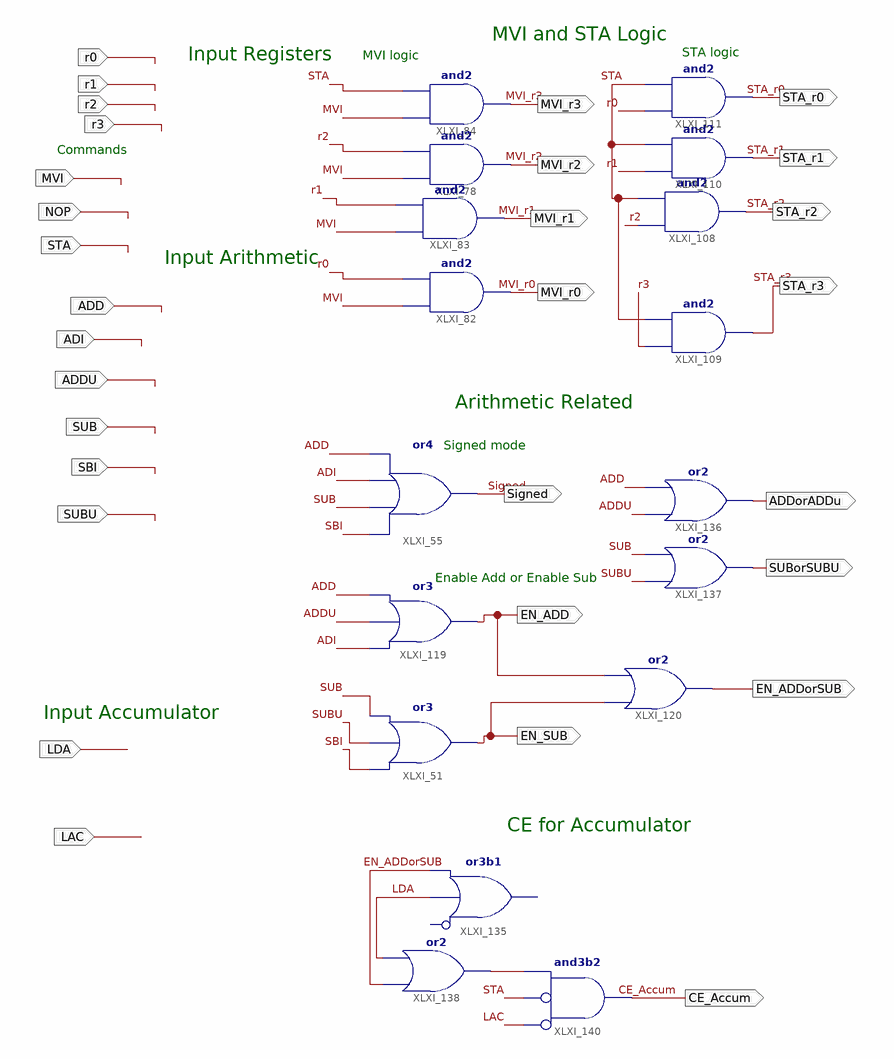
[diagram p0: schematic sheet 1]
// Xilinx ISE schematic ALU_Control_Logic.sch (spartan3e) as structural Verilog: 17 symbols, 30 ports
module ALU_Control_Logic (
  input  STA,
  input  MVI,
  input  r1,
  input  r0,
  input  r2,
  input  r3,
  input  NOP,
  input  ADD,
  input  ADI,
  input  ADDU,
  input  SUB,
  input  SBI,
  input  SUBU,
  input  LDA,
  input  LAC,
  output MVI_r3,
  output MVI_r2,
  output MVI_r1,
  output MVI_r0,
  output STA_r0,
  output STA_r1,
  output STA_r2,
  output STA_r3,
  output Signed,
  output EN_ADD,
  output EN_SUB,
  output EN_ADDorSUB,
  output SUBorSUBU,
  output ADDorADDu,
  output CE_Accum
);

  wire XLXN_1;

  and XLXI_84 (MVI_r3, MVI, STA);
  and XLXI_78 (MVI_r2, MVI, r2);
  and XLXI_83 (MVI_r1, MVI, r1);
  and XLXI_82 (MVI_r0, MVI, r0);
  and XLXI_108 (STA_r2, r2, STA);
  and XLXI_110 (STA_r1, r1, STA);
  and XLXI_111 (STA_r0, r0, STA);
  and XLXI_109 (STA_r3, r3, STA);
  or XLXI_55 (Signed, SBI, SUB, ADI, ADD);
  or XLXI_51 (EN_SUB, SBI, SUBU, SUB);
  or XLXI_119 (EN_ADD, ADI, ADDU, ADD);
  or XLXI_120 (EN_ADDorSUB, EN_SUB, EN_ADD);
  // or3b1 XLXI_135 has open pins: I0=open, I1=LDA, I2=EN_ADDorSUB, O=open
  or XLXI_136 (ADDorADDu, ADDU, ADD);
  or XLXI_137 (SUBorSUBU, SUBU, SUB);
  or XLXI_138 (XLXN_1, EN_ADDorSUB, LDA);
  and XLXI_140 (CE_Accum, ~LAC, ~STA, XLXN_1);  // and3b2

  // Notes on the sheet:
  //   MVI and STA Logic
  //   STA logic
  //   Input Registers
  //   MVI logic
  //   Commands
  //   Input Arithmetic
  //   Arithmetic Related
  //   Signed mode
  //   Enable Add or Enable Sub
  //   Input Accumulator
  //   CE for Accumulator
endmodule
